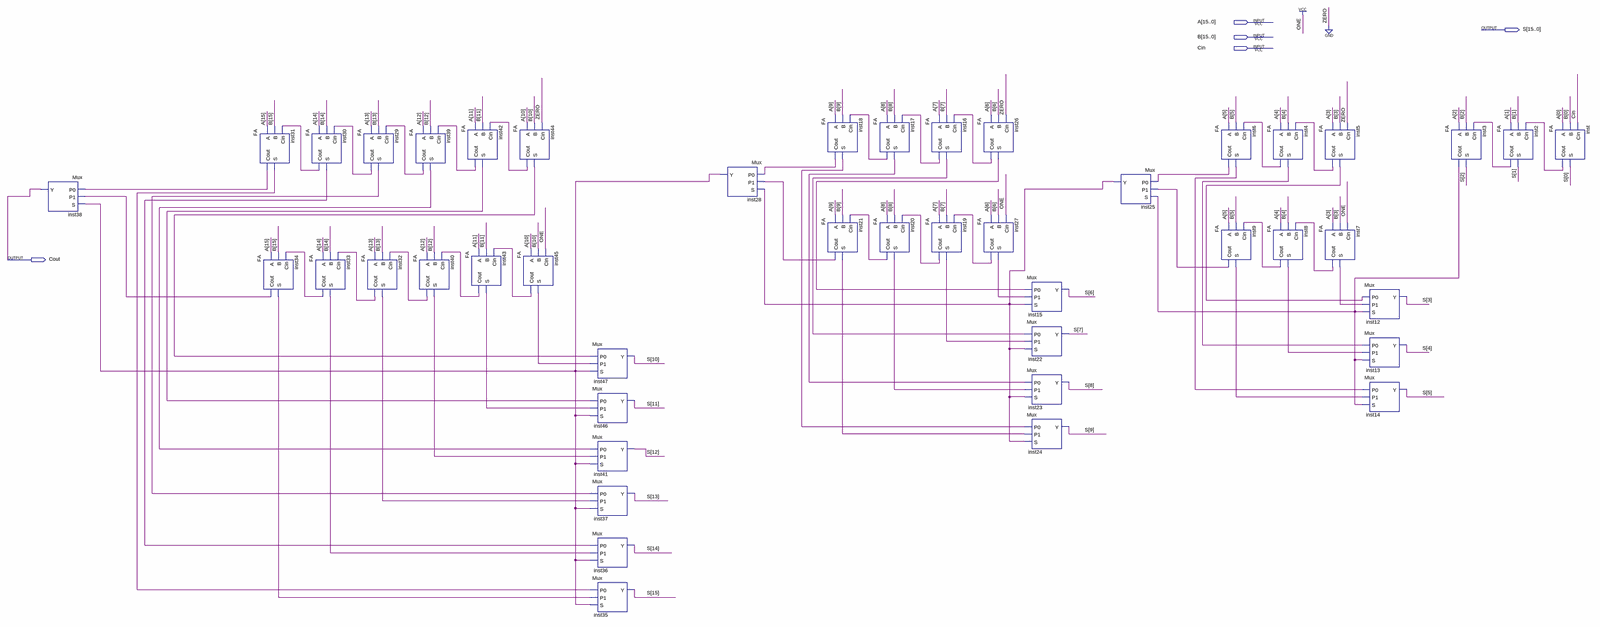
[diagram p0: schematic sheet, whole]
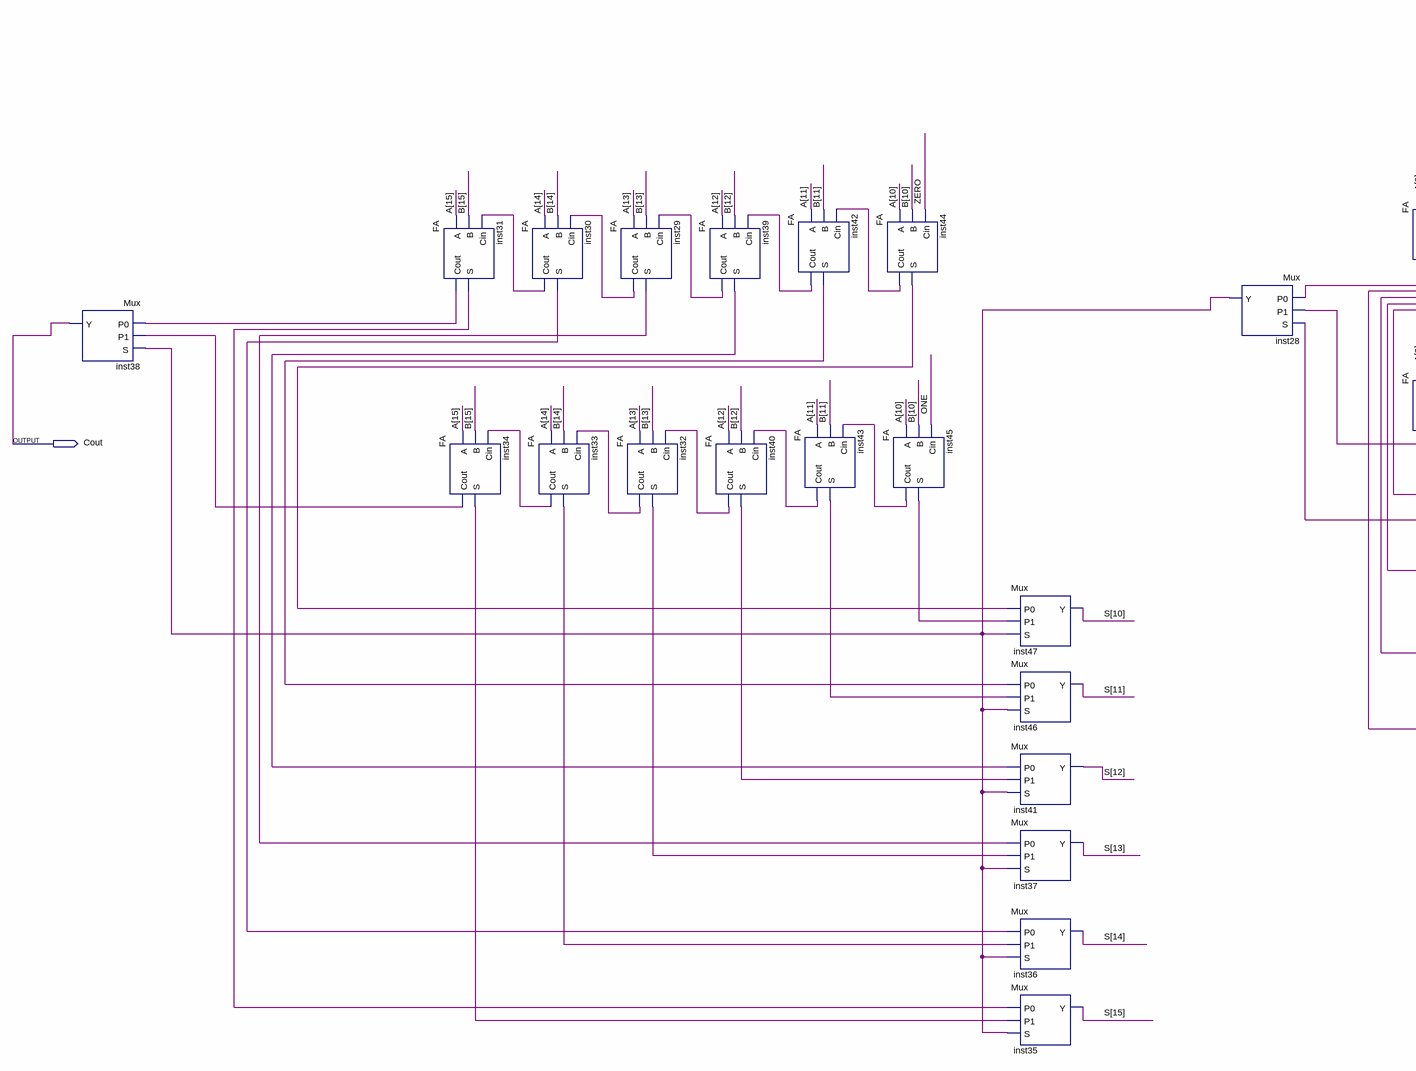
[diagram p1: schematic sheet, left part]
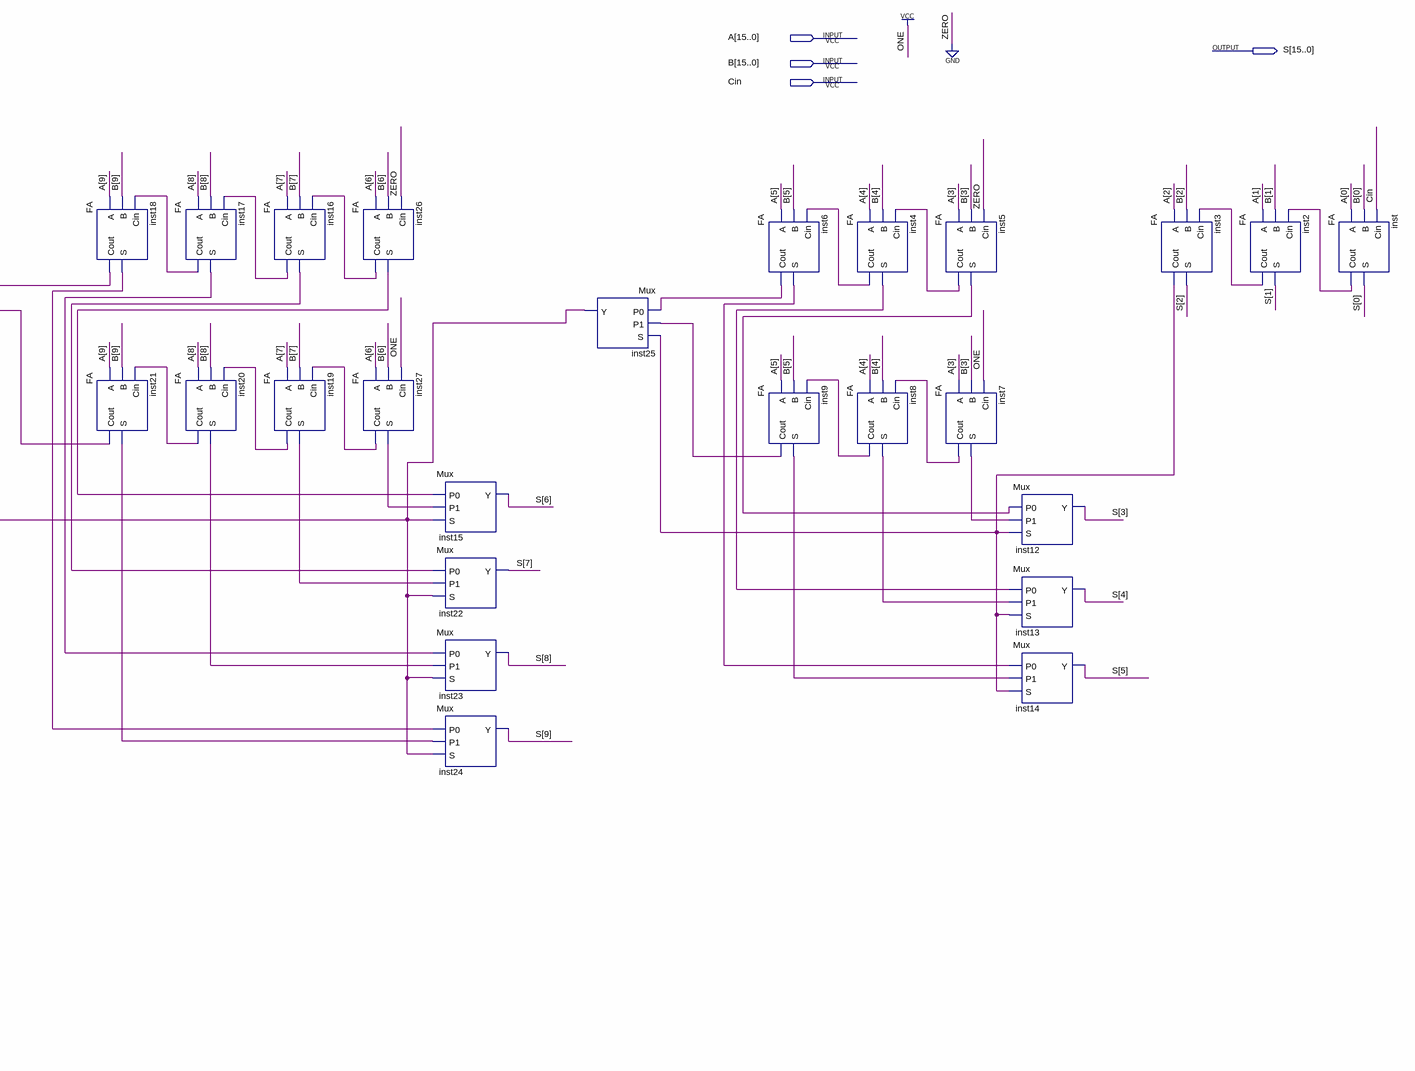
[diagram p2: schematic sheet, right part]
// Quartus schematic CarrySelectAdder16Bit.bdf as structural Verilog: 45 symbols, 5 pins
module CarrySelectAdder16Bit (
  input  [15:0] A,
  input  [15:0] B,
  input  Cin,
  output [15:0] S,
  output Cout
);

  wire inst2_cout, inst3_cout, inst4_cout, inst4_s, inst5_cout, inst5_s, inst6_cout, inst6_s, inst7_cout,
       inst7_s, inst8_cout, inst8_s, inst9_cout, inst9_s, inst16_cout, inst16_s, inst17_cout, inst17_s,
       inst18_cout, inst18_s, inst19_cout, inst19_s, inst20_cout, inst20_s, inst21_cout, inst21_s, inst25_y,
       inst26_cout, inst26_s, inst27_cout, inst27_s, inst28_y, inst29_cout, inst29_s, inst30_cout, inst30_s,
       inst31_cout, inst31_s, inst32_cout, inst32_s, inst33_cout, inst33_s, inst34_cout, inst34_s,
       inst39_cout, inst39_s, inst40_cout, inst40_s, inst42_cout, inst42_s, inst43_cout, inst43_s,
       inst44_cout, inst44_s, inst45_cout, inst45_s, inst_cout;

  Mux inst38 (.P0(inst31_cout), .P1(inst34_cout), .S(inst28_y), .Y(Cout));
  FA inst31 (.A(A[15]), .B(B[15]), .Cin(inst30_cout), .Cout(inst31_cout), .S(inst31_s));
  FA inst34 (.A(A[15]), .B(B[15]), .Cin(inst33_cout), .Cout(inst34_cout), .S(inst34_s));
  FA inst30 (.A(A[14]), .B(B[14]), .Cin(inst29_cout), .Cout(inst30_cout), .S(inst30_s));
  FA inst33 (.A(A[14]), .B(B[14]), .Cin(inst32_cout), .Cout(inst33_cout), .S(inst33_s));
  FA inst29 (.A(A[13]), .B(B[13]), .Cin(inst39_cout), .Cout(inst29_cout), .S(inst29_s));
  FA inst32 (.A(A[13]), .B(B[13]), .Cin(inst40_cout), .Cout(inst32_cout), .S(inst32_s));
  FA inst39 (.A(A[12]), .B(B[12]), .Cin(inst42_cout), .Cout(inst39_cout), .S(inst39_s));
  FA inst40 (.A(A[12]), .B(B[12]), .Cin(inst43_cout), .Cout(inst40_cout), .S(inst40_s));
  FA inst42 (.A(A[11]), .B(B[11]), .Cin(inst44_cout), .Cout(inst42_cout), .S(inst42_s));
  FA inst43 (.A(A[11]), .B(B[11]), .Cin(inst45_cout), .Cout(inst43_cout), .S(inst43_s));
  FA inst44 (.A(A[10]), .B(B[10]), .Cin(1'b0), .Cout(inst44_cout), .S(inst44_s));
  FA inst45 (.A(A[10]), .B(B[10]), .Cin(1'b1), .Cout(inst45_cout), .S(inst45_s));
  Mux inst47 (.P0(inst44_s), .P1(inst45_s), .S(inst28_y), .Y(S[10]));
  Mux inst46 (.P0(inst42_s), .P1(inst43_s), .S(inst28_y), .Y(S[11]));
  Mux inst41 (.P0(inst39_s), .P1(inst40_s), .S(inst28_y), .Y(S[12]));
  Mux inst37 (.P0(inst29_s), .P1(inst32_s), .S(inst28_y), .Y(S[13]));
  Mux inst36 (.P0(inst30_s), .P1(inst33_s), .S(inst28_y), .Y(S[14]));
  Mux inst35 (.P0(inst31_s), .P1(inst34_s), .S(inst28_y), .Y(S[15]));
  Mux inst28 (.P0(inst18_cout), .P1(inst21_cout), .S(inst25_y), .Y(inst28_y));
  FA inst18 (.A(A[9]), .B(B[9]), .Cin(inst17_cout), .Cout(inst18_cout), .S(inst18_s));
  FA inst21 (.A(A[9]), .B(B[9]), .Cin(inst20_cout), .Cout(inst21_cout), .S(inst21_s));
  FA inst17 (.A(A[8]), .B(B[8]), .Cin(inst16_cout), .Cout(inst17_cout), .S(inst17_s));
  FA inst20 (.A(A[8]), .B(B[8]), .Cin(inst19_cout), .Cout(inst20_cout), .S(inst20_s));
  FA inst16 (.A(A[7]), .B(B[7]), .Cin(inst26_cout), .Cout(inst16_cout), .S(inst16_s));
  FA inst19 (.A(A[7]), .B(B[7]), .Cin(inst27_cout), .Cout(inst19_cout), .S(inst19_s));
  FA inst26 (.A(A[6]), .B(B[6]), .Cin(1'b0), .Cout(inst26_cout), .S(inst26_s));
  FA inst27 (.A(A[6]), .B(B[6]), .Cin(1'b1), .Cout(inst27_cout), .S(inst27_s));
  Mux inst15 (.P0(inst26_s), .P1(inst27_s), .S(inst25_y), .Y(S[6]));
  Mux inst22 (.P0(inst16_s), .P1(inst19_s), .S(inst25_y), .Y(S[7]));
  Mux inst23 (.P0(inst17_s), .P1(inst20_s), .S(inst25_y), .Y(S[8]));
  Mux inst24 (.P0(inst18_s), .P1(inst21_s), .S(inst25_y), .Y(S[9]));
  Mux inst25 (.P0(inst6_cout), .P1(inst9_cout), .S(inst3_cout), .Y(inst25_y));
  FA inst6 (.A(A[5]), .B(B[5]), .Cin(inst4_cout), .Cout(inst6_cout), .S(inst6_s));
  FA inst9 (.A(A[5]), .B(B[5]), .Cin(inst8_cout), .Cout(inst9_cout), .S(inst9_s));
  FA inst4 (.A(A[4]), .B(B[4]), .Cin(inst5_cout), .Cout(inst4_cout), .S(inst4_s));
  FA inst8 (.A(A[4]), .B(B[4]), .Cin(inst7_cout), .Cout(inst8_cout), .S(inst8_s));
  FA inst5 (.A(A[3]), .B(B[3]), .Cin(1'b0), .Cout(inst5_cout), .S(inst5_s));
  FA inst7 (.A(A[3]), .B(B[3]), .Cin(1'b1), .Cout(inst7_cout), .S(inst7_s));
  Mux inst12 (.P0(inst5_s), .P1(inst7_s), .S(inst3_cout), .Y(S[3]));
  Mux inst13 (.P0(inst4_s), .P1(inst8_s), .S(inst3_cout), .Y(S[4]));
  Mux inst14 (.P0(inst6_s), .P1(inst9_s), .S(inst3_cout), .Y(S[5]));
  FA inst3 (.A(A[2]), .B(B[2]), .Cin(inst2_cout), .Cout(inst3_cout), .S(S[2]));
  FA inst2 (.A(A[1]), .B(B[1]), .Cin(inst_cout), .Cout(inst2_cout), .S(S[1]));
  FA inst (.A(A[0]), .B(B[0]), .Cin(Cin), .Cout(inst_cout), .S(S[0]));
endmodule
